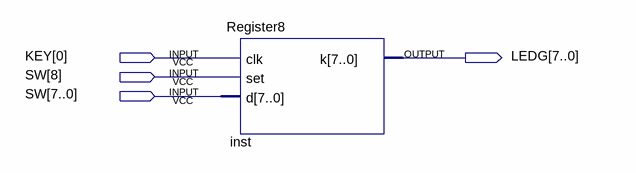
[diagram p0: schematic sheet]
// Quartus schematic RegisterDemo.bdf as structural Verilog: 1 symbols, 4 pins
module RegisterDemo (
  input  [0:0] KEY,
  input  [8:0] SW,
  output [7:0] LEDG
);

  Register8 inst (.clk(KEY[0]), .set(SW[8]), .d(SW[7:0]), .k(LEDG));
endmodule
